# Altium schematic sheet MCU.SchDoc
size 420 x 297 mm; Author: AzekClark; CompanyName: AzekClark; Address1: Address1; Address2: Address2; Address3: Address3; Address4: Address4; DocumentNumber: StairsLED; SheetNumber: 1; SheetTotal: 4; Scale: 1:1; DocumentType: Схема электрическая принципиальная; FirstReferrence: StairsLED
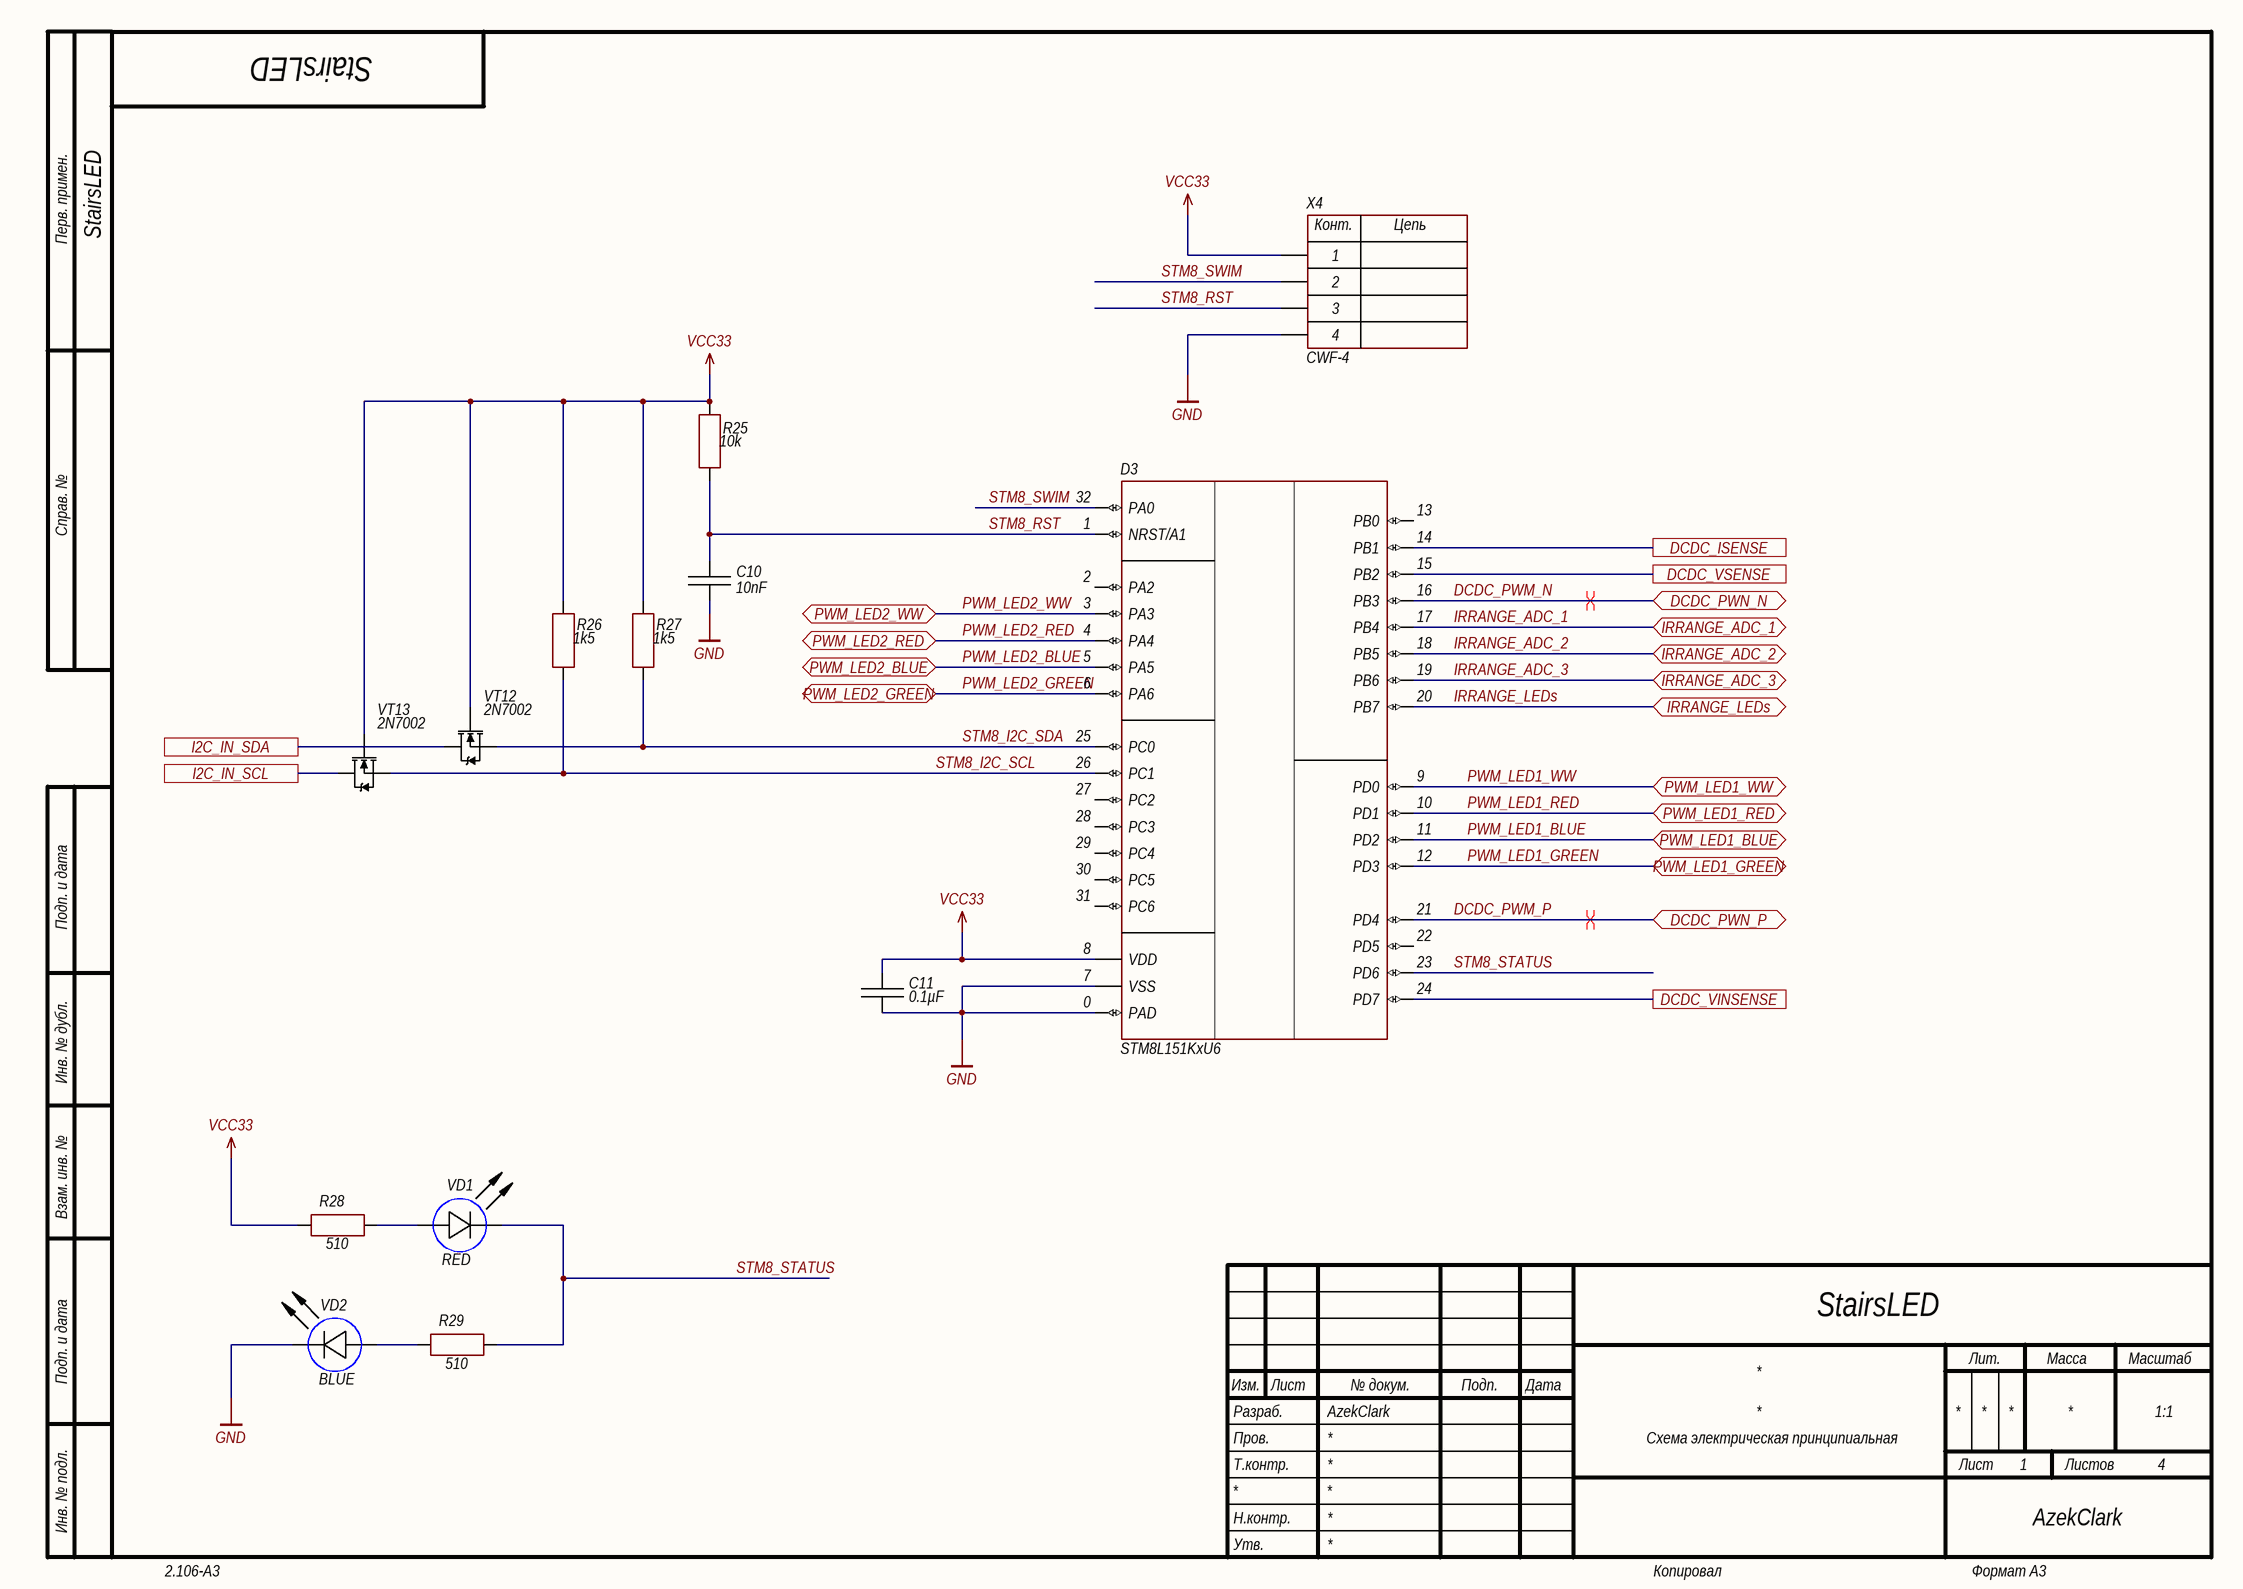
[diagram p0: MCU.SchDoc]

## Parts
C10  10nF  [CH0603C]
C11  0.1µF  [CH0603C]
D3  STM8L151KxU6  [32-UFQFPN]
R25  10k  [CH0603R]
R26  1k5  [CH0603R]
R27  1k5  [CH0603R]
R28  510  [CH0603R]
R29  510  [CH0603R]
VD1  RED  [CH0603LR]
VD2  BLUE  [CH0603LB]
VT12  2N7002  [SOT23_132]
VT13  2N7002  [SOT23_132]
X4  CWF-4  [CON: CWF-4]

## Ports
DCDC_ISENSE, DCDC_PWN_N (bidir), DCDC_PWN_P (bidir), DCDC_VINSENSE, DCDC_VSENSE, I2C_IN_SCL, I2C_IN_SDA, IRRANGE_ADC_1 (bidir), IRRANGE_ADC_2 (bidir), IRRANGE_ADC_3 (bidir), IRRANGE_LEDs (bidir), PWM_LED1_BLUE (bidir), PWM_LED1_GREEN (bidir), PWM_LED1_RED (bidir), PWM_LED1_WW (bidir), PWM_LED2_BLUE (bidir), PWM_LED2_GREEN (bidir), PWM_LED2_RED (bidir), PWM_LED2_WW (bidir)

## Nets
GND: C10.1 C11.2 D3.0(PAD) D3.7(VSS) VD2.2(C) X4.4
VCC33: C11.1 D3.8(VDD) R25.2 R26.2 R27.2 R28.2 VT12.1(G) VT13.1(G) X4.1
DCDC_ISENSE: D3.14(PB1) ; port DCDC_ISENSE
DCDC_PWM_N: D3.16(PB3) ; port DCDC_PWN_N
DCDC_PWM_P: D3.21(PD4) ; port DCDC_PWN_P
DCDC_VINSENSE: D3.24(PD7) ; port DCDC_VINSENSE
DCDC_VSENSE: D3.15(PB2) ; port DCDC_VSENSE
I2C_IN_SCL: VT13.2(D) ; port I2C_IN_SCL
I2C_IN_SDA: VT12.2(D) ; port I2C_IN_SDA
IRRANGE_ADC_1: D3.17(PB4) ; port IRRANGE_ADC_1
IRRANGE_ADC_2: D3.18(PB5) ; port IRRANGE_ADC_2
IRRANGE_ADC_3: D3.19(PB6) ; port IRRANGE_ADC_3
IRRANGE_LEDs: D3.20(PB7) ; port IRRANGE_LEDs
PWM_LED1_BLUE: D3.11(PD2) ; port PWM_LED1_BLUE
PWM_LED1_GREEN: D3.12(PD3) ; port PWM_LED1_GREEN
PWM_LED1_RED: D3.10(PD1) ; port PWM_LED1_RED
PWM_LED1_WW: D3.9(PD0) ; port PWM_LED1_WW
PWM_LED2_BLUE: D3.5(PA5) ; port PWM_LED2_BLUE
PWM_LED2_GREEN: D3.6(PA6) ; port PWM_LED2_GREEN
PWM_LED2_RED: D3.4(PA4) ; port PWM_LED2_RED
PWM_LED2_WW: D3.3(PA3) ; port PWM_LED2_WW
STM8_I2C_SCL: D3.26(PC1) R26.1 VT13.3(S)
STM8_I2C_SDA: D3.25(PC0) R27.1 VT12.3(S)
STM8_RST: C10.2 D3.1(NRST/A1) R25.1 X4.3
STM8_STATUS: D3.23(PD6) R29.1 VD1.2(C)
STM8_SWIM: D3.32(PA0) X4.2
NetR28_1: R28.1 VD1.1(A)
NetR29_2: R29.2 VD2.1(A)

Not connected (* = marked no-connect by the designer): D3 2(PA2) 13(PB0) 22(PD5) 27(PC2) 28(PC3) 29(PC4) 30(PC5) 31(PC6)

## Layout directives
differential pair: DCDC_PWM_N, DCDC_PWM_P

## Notes on the sheet
- Перв. примен.
- Справ. №
- Подп. и дата
- Инв. № дубл.
- Взам. инв. №
- Разраб.
- Изм.
- Лист
- № докум.
- Подп.
- Дата
- Лит.
- Масса
- Масштаб
- Пров.
- Т.контр.
- Листов
- Инв. № подл.
- Утв.
- Н.контр.
- 2.106-A3
- Копировал
- Формат А3
- (in symbol 4-Connector) Конт.; Цепь

## Library data of the parts
C10 C11 = Capacitor: Manufacturer: *; Model: *; HelpURL: *; ComponentKind: *
  C10: Value: 10nF
  C11: Value: 0.1µF
D3 = STM8L151KxU6: STM8; Manufacturer: ST Microelectronics; Model: STM8L151GxU6; ComponentKind: UFQFPN28; HelpURL: https://ru.mouser.com/datasheet/2/389/stm8l151c4-956418.pdf
R25-R29 = Resistor: Manufacturer: *; Model: *; HelpURL: *; ComponentKind: *
  R25: Value: 10k
  R26 R27: Value: 1k5
  R28 R29: Value: 510
VD1 VD2 = LED: Manufacturer: *; Model: *; HelpURL: *; ComponentKind: *
  VD1: Value: RED
  VD2: Value: BLUE
VT12 VT13 = N-chanel: Mosfet; Manufacturer: ON Semiconductor; Model: 2N7002; ComponentKind: 0.2А, 60В; HelpURL: https://static.chipdip.ru/lib/318/DOC000318735.pdf
X4 = 4-Connector: Model: CWF-4; Manufacturer: *; HelpURL: *; ComponentKind: *